# EAGLE design hula_poppy (EAGLE 6.4)

## Sheet 1 of 2
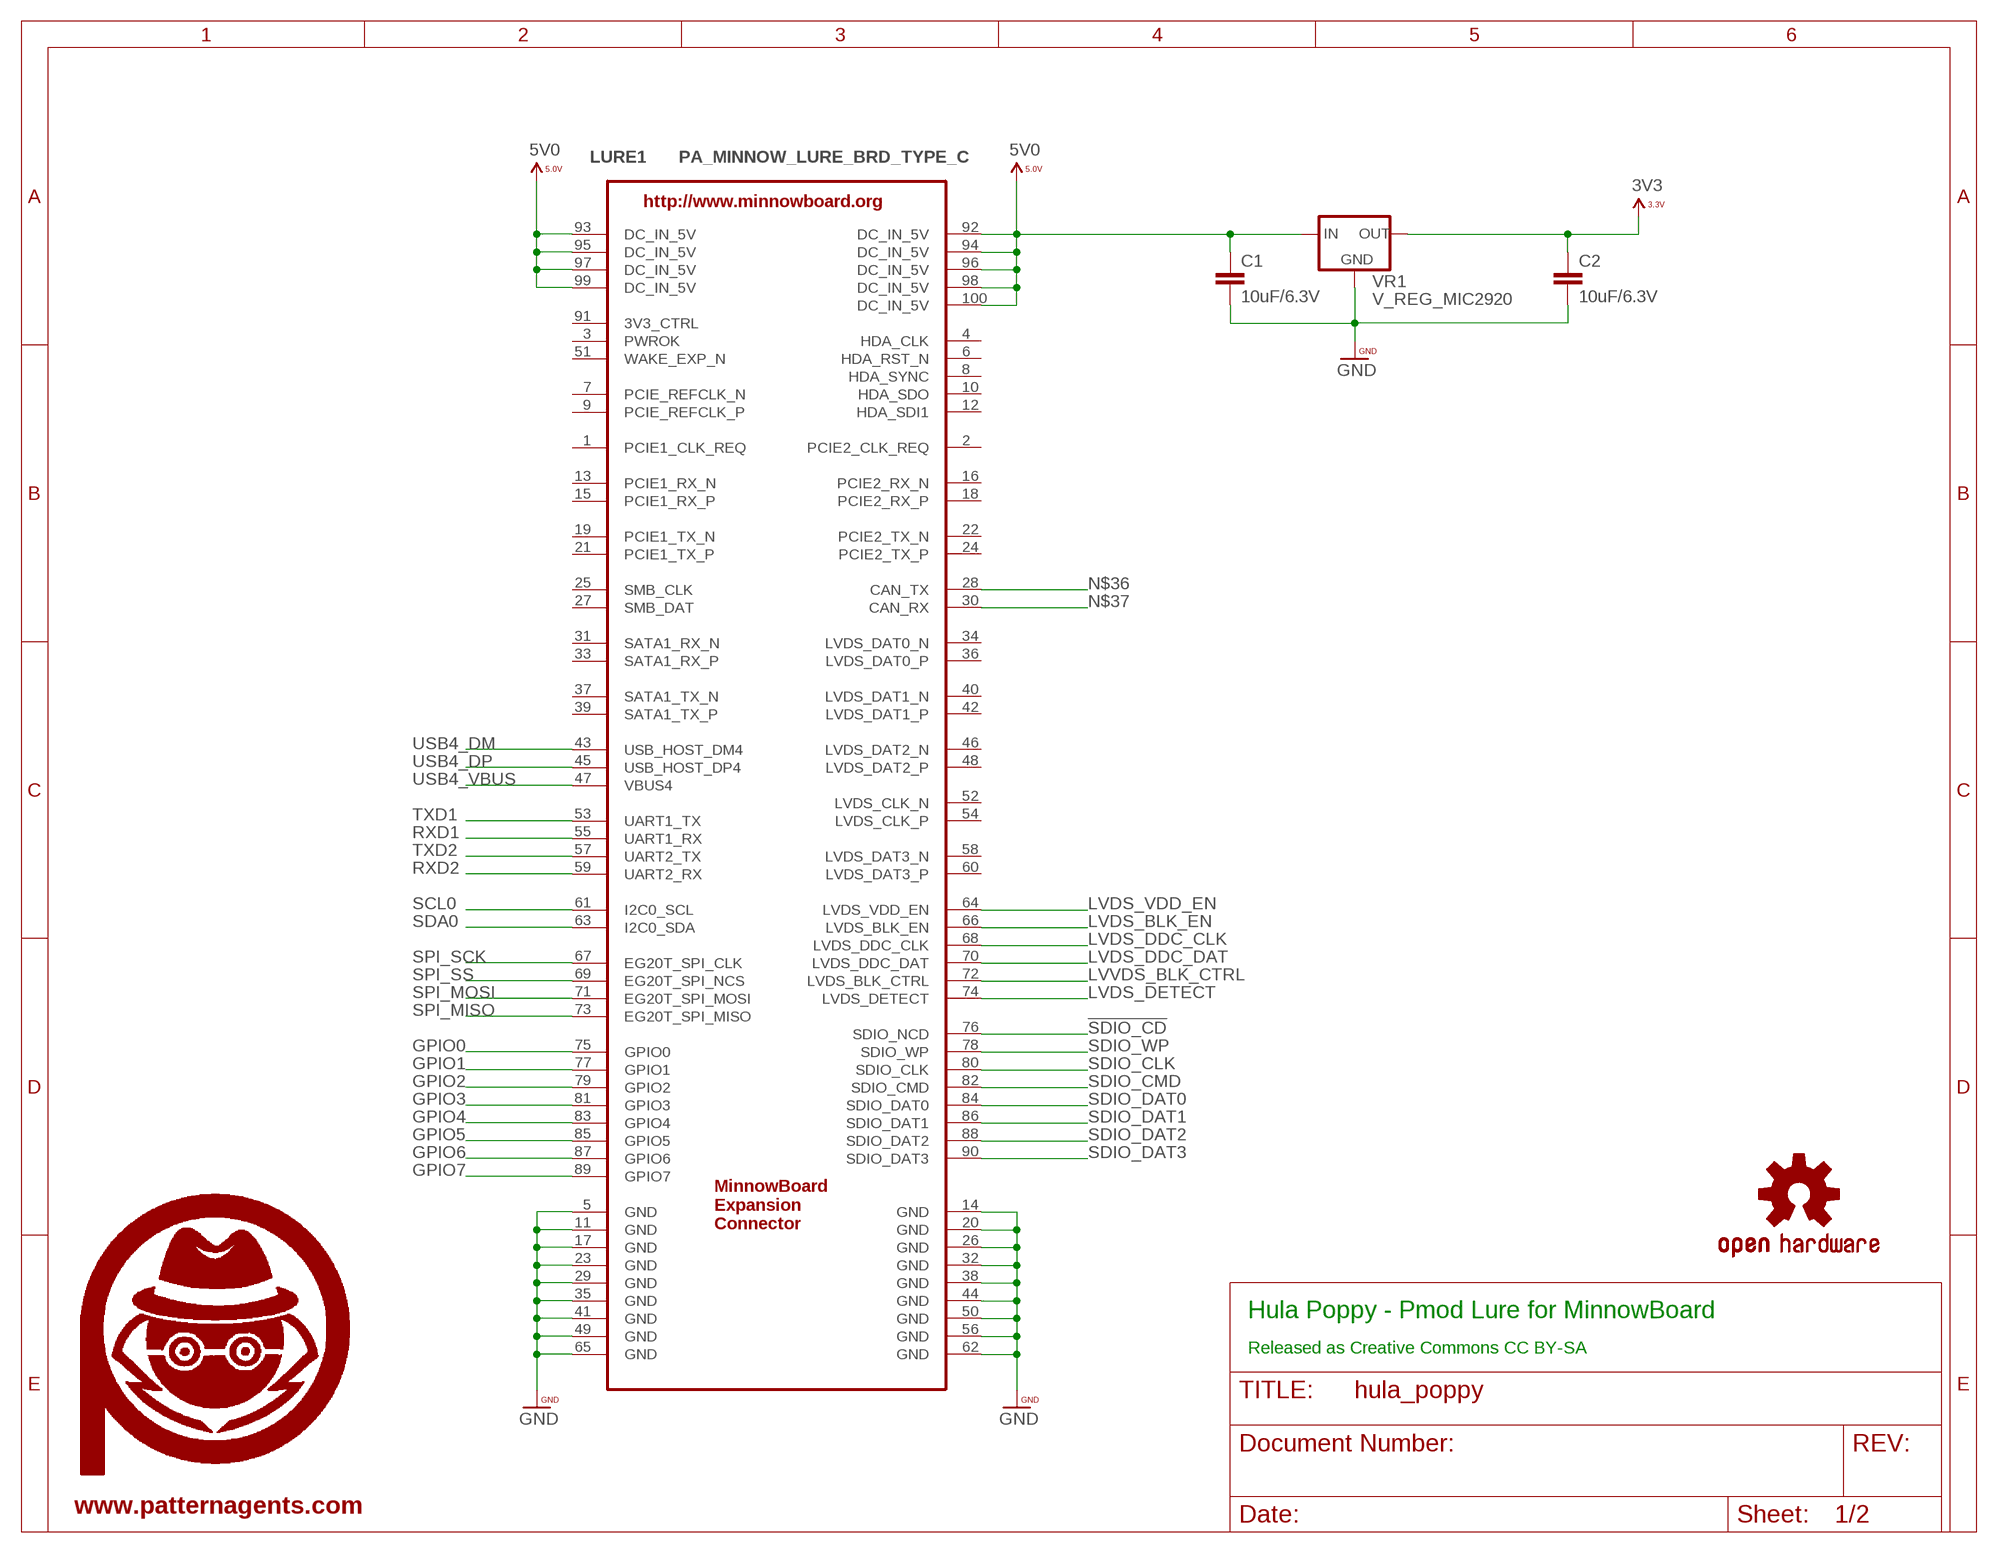
[diagram p0: schematic, sheet 1]

### Parts
C1  10uF/6.3V  CAP0603-CAP  [0603-CAP]
C2  10uF/6.3V  CAP0603-CAP  [0603-CAP]
LURE1  PA_MINNOW_LURE_BRD_TYPE_C  [PA_LURE_TYPE_C]
U$6  PA_LOGO_SYMMED  [PA_LOGO_AGENT_MED_SYM]
U$8  OSHW_LOGO_SYMWTXT  [OSHW_LOGO_TEXT_SYM]
VR1  V_REG_MIC2920  [SOT223]

### Nets
3V3: C2.1 VR1.3(OUT) ; also sheet 2
5V0: C1.1 LURE1.92(DC_IN_5V) LURE1.93(DC_IN_5V) LURE1.94(DC_IN_5V) LURE1.95(DC_IN_5V) LURE1.96(DC_IN_5V) LURE1.97(DC_IN_5V) LURE1.98(DC_IN_5V) LURE1.99(DC_IN_5V) LURE1.100(DC_IN_5V) VR1.1(IN)
!SDIO_CD: LURE1.76(SDIO_NCD) ; also sheet 2
GND: C1.2 C2.2 LURE1.5(GND) LURE1.11(GND) LURE1.14(GND) LURE1.17(GND) LURE1.20(GND) LURE1.23(GND) LURE1.26(GND) LURE1.29(GND) LURE1.32(GND) LURE1.35(GND) LURE1.38(GND) LURE1.41(GND) LURE1.44(GND) LURE1.49(GND) LURE1.50(GND) LURE1.56(GND) LURE1.62(GND) LURE1.65(GND) VR1.2(GND) ; also sheet 2
GPIO0: LURE1.75(GPIO0) ; also sheet 2
GPIO1: LURE1.77(GPIO1) ; also sheet 2
GPIO2: LURE1.79(GPIO2) ; also sheet 2
GPIO3: LURE1.81(GPIO3) ; also sheet 2
GPIO4: LURE1.83(GPIO4) ; also sheet 2
GPIO5: LURE1.85(GPIO5) ; also sheet 2
GPIO6: LURE1.87(GPIO6) ; also sheet 2
GPIO7: LURE1.89(GPIO7) ; also sheet 2
LVDS_BLK_EN: LURE1.66(LVDS_BLK_EN)
LVDS_DDC_CLK: LURE1.68(LVDS_DDC_CLK)
LVDS_DDC_DAT: LURE1.70(LVDS_DDC_DAT)
LVDS_DETECT: LURE1.74(LVDS_DETECT)
LVDS_VDD_EN: LURE1.64(LVDS_VDD_EN)
LVVDS_BLK_CTRL: LURE1.72(LVDS_BLK_CTRL)
N$36: LURE1.28(CAN_TX)
N$37: LURE1.30(CAN_RX)
RXD1: LURE1.55(UART1_RX) ; also sheet 2
RXD2: LURE1.59(UART2_RX) ; also sheet 2
SCL0: LURE1.61(I2C0_SCL) ; also sheet 2
SDA0: LURE1.63(I2C0_SDA) ; also sheet 2
SDIO_CLK: LURE1.80(SDIO_CLK) ; also sheet 2
SDIO_CMD: LURE1.82(SDIO_CMD) ; also sheet 2
SDIO_DAT0: LURE1.84(SDIO_DAT0) ; also sheet 2
SDIO_DAT1: LURE1.86(SDIO_DAT1) ; also sheet 2
SDIO_DAT2: LURE1.88(SDIO_DAT2) ; also sheet 2
SDIO_DAT3: LURE1.90(SDIO_DAT3) ; also sheet 2
SDIO_WP: LURE1.78(SDIO_WP) ; also sheet 2
SPI_MISO: LURE1.73(EG20T_SPI_MISO) ; also sheet 2
SPI_MOSI: LURE1.71(EG20T_SPI_MOSI) ; also sheet 2
SPI_SCK: LURE1.67(EG20T_SPI_CLK) ; also sheet 2
SPI_SS: LURE1.69(EG20T_SPI_NCS) ; also sheet 2
TXD1: LURE1.53(UART1_TX) ; also sheet 2
TXD2: LURE1.57(UART2_TX) ; also sheet 2
USB4_DM: LURE1.43(USB_HOST_DM4)
USB4_DP: LURE1.45(USB_HOST_DP4)
USB4_VBUS: LURE1.47(VBUS4)
Unconnected: LURE1.1(PCIE1_CLK_REQ) LURE1.2(PCIE2_CLK_REQ) LURE1.3(PWROK) LURE1.4(HDA_CLK) LURE1.6(HDA_RST_N) LURE1.7(PCIE_REFCLK_N) LURE1.8(HDA_SYNC) LURE1.9(PCIE_REFCLK_P) LURE1.10(HDA_SDO) LURE1.12(HDA_SDI1) LURE1.13(PCIE1_RX_N) LURE1.15(PCIE1_RX_P) LURE1.16(PCIE2_RX_N) LURE1.18(PCIE2_RX_P) LURE1.19(PCIE1_TX_N) LURE1.21(PCIE1_TX_P) LURE1.22(PCIE2_TX_N) LURE1.24(PCIE2_TX_P) LURE1.25(SMB_CLK) LURE1.27(SMB_DAT) LURE1.31(SATA1_RX_N) LURE1.33(SATA1_RX_P) LURE1.34(LVDS_DAT0_N) LURE1.36(LVDS_DAT0_P) LURE1.37(SATA1_TX_N) LURE1.39(SATA1_TX_P) LURE1.40(LVDS_DAT1_N) LURE1.42(LVDS_DAT1_P) LURE1.46(LVDS_DAT2_N) LURE1.48(LVDS_DAT2_P) LURE1.51(WAKE_EXP_N) LURE1.52(LVDS_CLK_N) LURE1.54(LVDS_CLK_P) LURE1.58(LVDS_DAT3_N) LURE1.60(LVDS_DAT3_P)

### Notes on the sheet
- Hula Poppy - Pmod Lure for MinnowBoard
- Released as Creative Commons CC BY-SA
- www.patternagents.com

## Sheet 2 of 2
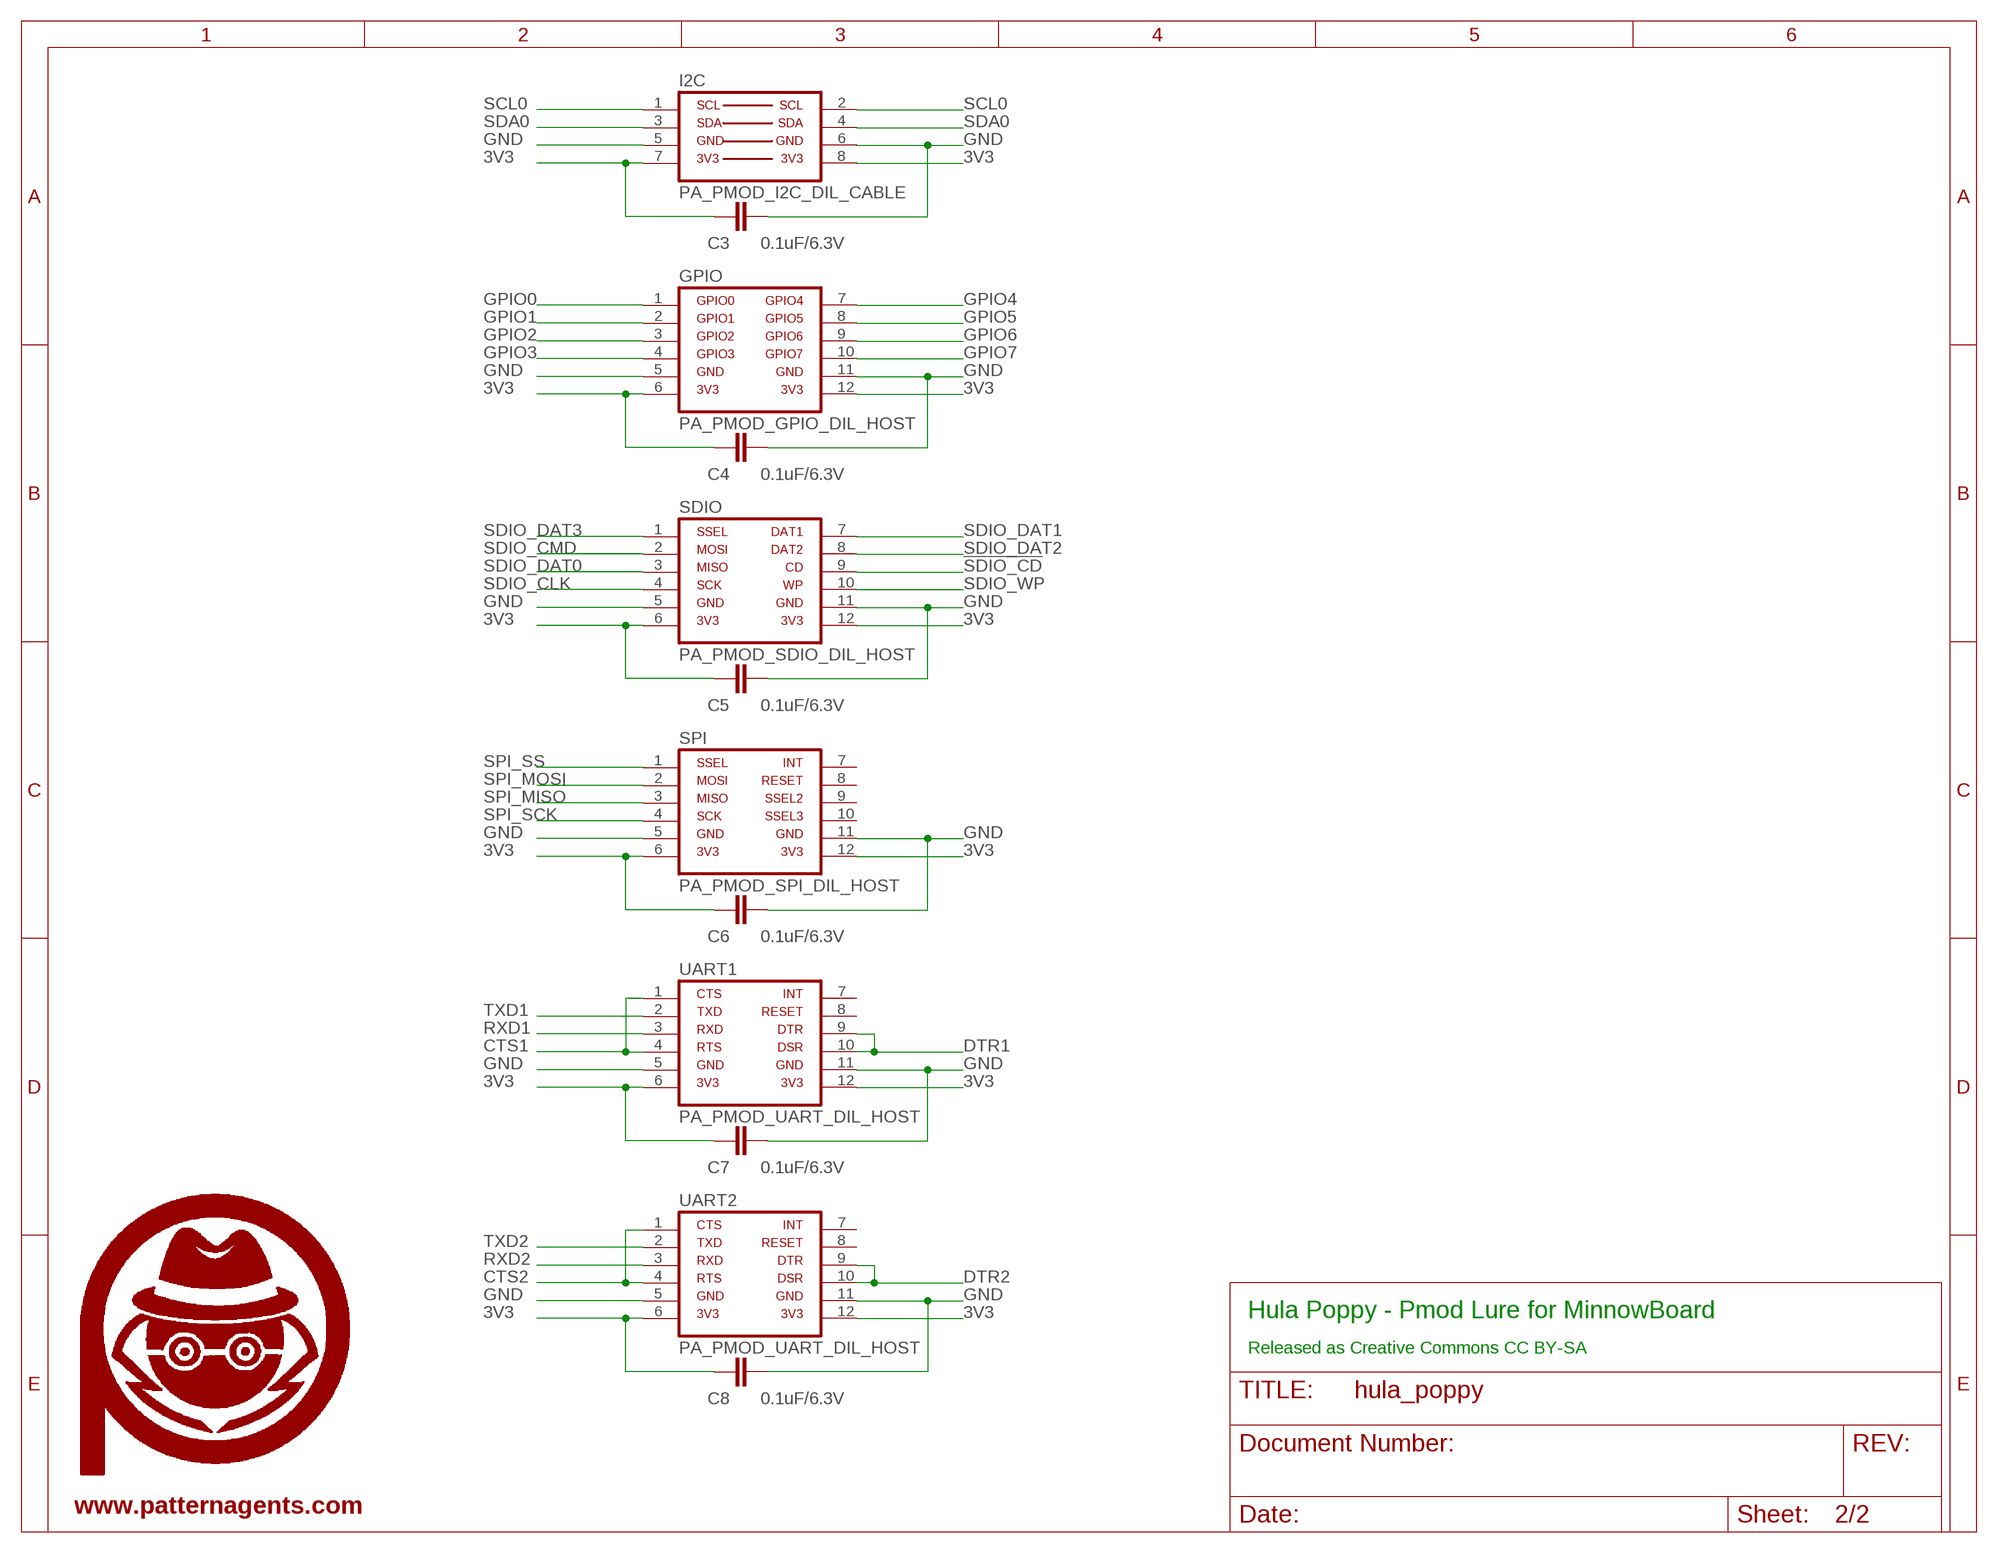
[diagram p1: schematic, sheet 2]

### Parts
C3  0.1uF/6.3V  CAP0603-CAP  [0603-CAP]
C4  0.1uF/6.3V  CAP0603-CAP  [0603-CAP]
C5  0.1uF/6.3V  CAP0603-CAP  [0603-CAP]
C6  0.1uF/6.3V  CAP0603-CAP  [0603-CAP]
C7  0.1uF/6.3V  CAP0603-CAP  [0603-CAP]
C8  0.1uF/6.3V  CAP0603-CAP  [0603-CAP]
GPIO  PA_PMOD_GPIO_DIL_HOST  [PA_PMOD_DIL_FEMALE]
I2C  PA_PMOD_I2C_DIL_CABLE  [PA_PMOD_I2C_CABLE]
SDIO  PA_PMOD_SDIO_DIL_HOST  [PA_PMOD_DIL_FEMALE]
SPI  PA_PMOD_SPI_DIL_HOST  [PA_PMOD_DIL_FEMALE]
U$10  PA_LOGO_SYMMED  [PA_LOGO_AGENT_MED_SYM]
UART1  PA_PMOD_UART_DIL_HOST  [PA_PMOD_DIL_FEMALE]
UART2  PA_PMOD_UART_DIL_HOST  [PA_PMOD_DIL_FEMALE]

### Nets
3V3: C3.2 C4.2 C5.2 C6.2 C7.2 C8.2 GPIO.6 GPIO.12 I2C.7 I2C.8 SDIO.6 SDIO.12 SPI.6 SPI.12 UART1.6 UART1.12 UART2.6 UART2.12 ; also sheet 1
!SDIO_CD: SDIO.9 ; also sheet 1
CTS1: UART1.1 UART1.4
CTS2: UART2.1 UART2.4
DTR1: UART1.9 UART1.10
DTR2: UART2.9 UART2.10
GND: C3.1 C4.1 C5.1 C6.1 C7.1 C8.1 GPIO.5 GPIO.11 I2C.5 I2C.6 SDIO.5 SDIO.11 SPI.5 SPI.11 UART1.5 UART1.11 UART2.5 UART2.11 ; also sheet 1
GPIO0: GPIO.1 ; also sheet 1
GPIO1: GPIO.2 ; also sheet 1
GPIO2: GPIO.3 ; also sheet 1
GPIO3: GPIO.4 ; also sheet 1
GPIO4: GPIO.7 ; also sheet 1
GPIO5: GPIO.8 ; also sheet 1
GPIO6: GPIO.9 ; also sheet 1
GPIO7: GPIO.10 ; also sheet 1
RXD1: UART1.3 ; also sheet 1
RXD2: UART2.3 ; also sheet 1
SCL0: I2C.1 I2C.2 ; also sheet 1
SDA0: I2C.3 I2C.4 ; also sheet 1
SDIO_CLK: SDIO.4 ; also sheet 1
SDIO_CMD: SDIO.2 ; also sheet 1
SDIO_DAT0: SDIO.3 ; also sheet 1
SDIO_DAT1: SDIO.7 ; also sheet 1
SDIO_DAT2: SDIO.8 ; also sheet 1
SDIO_DAT3: SDIO.1 ; also sheet 1
SDIO_WP: SDIO.10 ; also sheet 1
SPI_MISO: SPI.3 ; also sheet 1
SPI_MOSI: SPI.2 ; also sheet 1
SPI_SCK: SPI.4 ; also sheet 1
SPI_SS: SPI.1 ; also sheet 1
TXD1: UART1.2 ; also sheet 1
TXD2: UART2.2 ; also sheet 1
Unconnected: SPI.7 SPI.8 SPI.9 SPI.10 UART1.7 UART1.8 UART2.7 UART2.8

### Notes on the sheet
- Hula Poppy - Pmod Lure for MinnowBoard
- Released as Creative Commons CC BY-SA
- www.patternagents.com

## Power pins joined to a net without a drawn wire
3V3_CTRL: LURE1.91(3V3_CTRL)

## Library data of the parts
C1-C8 = PatternAgents-Misc:CAP: Capacitor Standard 0603 ceramic capacitor, and 0.1" leaded capacitor.
GPIO = PatternAgents_Interface:PA_PMOD_GPIO_DIL: PatternAgents Peripheral Module GPIO (Type 1A) Pattern Source LBR : http://www.patternagents.com Github : https://github.com/patternagents Source License : http://www.digilentinc.com/Pmods/licensing.cfm Source Data : http://www.digilentinc.com/Pmods/Digilent-Pmod_%20Interface_Specification.pdf The name "Pmod™" is the trademark of Digilent Inc. PA Pattern License : http://creativecommons.org/licenses/by-sa/4.0/ (Creative Commons 4.0) THIS SOFTWARE IS PROVIDED BY THE CONTRIBUTORS "AS IS" AND WITHOUT ANY EXPRESS OR IMPLIED WARRANTIES, INCLUDING, BUT NOT LIMITED TO, THE IMPLIED WARRANTIES OF MERCHANTABILITY AND FITNESS FOR A PARTICULAR PURPOSE ARE DISCLAIMED. IN NO EVENT SHALL THE COPYRIGHT OWNER OR CONTRIBUTORS BE LIABLE FOR ANY DIRECT, INDIRECT, INCIDENTAL, SPECIAL, EXEMPLARY, OR CONSEQUENTIAL DAMAGES (INCLUDING, BUT NOT LIMITED TO, PROCUREMENT OF SUBSTITUTE GOODS OR SERVICES; LOSS OF USE, DATA, OR PROFITS; OR BUSINESS INTERRUPTION) HOWEVER CAUSED AND ON ANY THEORY OF LIABILITY, WHETHER IN CONTRACT, STRICT LIABILITY, OR TORT (INCLUDING NEGLIGENCE OR OTHERWISE) ARISING IN ANY WAY OUT OF THE USE OF THIS SOFTWARE, EVEN IF ADVISED OF THE POSSIBILITY OF SUCH DAMAGE.
I2C = PatternAgents_Interface:PA_PMOD_I2C_DIL: PatternAgents Peripheral Module I2C (Standard) Pattern Source LBR : http://www.patternagents.com Github : https://github.com/patternagents Source License : http://www.digilentinc.com/Pmods/licensing.cfm Source Data : http://www.digilentinc.com/Pmods/Digilent-Pmod_%20Interface_Specification.pdf The name "Pmod™" is the trademark of Digilent Inc. PA Pattern License : http://creativecommons.org/licenses/by-sa/4.0/ (Creative Commons 4.0) THIS SOFTWARE IS PROVIDED BY THE CONTRIBUTORS "AS IS" AND WITHOUT ANY EXPRESS OR IMPLIED WARRANTIES, INCLUDING, BUT NOT LIMITED TO, THE IMPLIED WARRANTIES OF MERCHANTABILITY AND FITNESS FOR A PARTICULAR PURPOSE ARE DISCLAIMED. IN NO EVENT SHALL THE COPYRIGHT OWNER OR CONTRIBUTORS BE LIABLE FOR ANY DIRECT, INDIRECT, INCIDENTAL, SPECIAL, EXEMPLARY, OR CONSEQUENTIAL DAMAGES (INCLUDING, BUT NOT LIMITED TO, PROCUREMENT OF SUBSTITUTE GOODS OR SERVICES; LOSS OF USE, DATA, OR PROFITS; OR BUSINESS INTERRUPTION) HOWEVER CAUSED AND ON ANY THEORY OF LIABILITY, WHETHER IN CONTRACT, STRICT LIABILITY, OR TORT (INCLUDING NEGLIGENCE OR OTHERWISE) ARISING IN ANY WAY OUT OF THE USE OF THIS SOFTWARE, EVEN IF ADVISED OF THE POSSIBILITY OF SUCH DAMAGE.
LURE1 = PatternAgents-Boards:PA_MINNOW_LURE_BRD: PatternAgents Minnow Lure Pattern Source LBR : http://www.patternagents.com Github : https://github.com/patternagents Source Data : http://www.minnowboard.org/ Source Data : http://www.elinux.org/Minnowboard:Lures_Specifications Note Bene : The larger "Type A" format Lures will require a Standard or Professional Eagle License, due to their larger size (4.2" x 4.2"). License : http://creativecommons.org/licenses/by-sa/4.0/ (Creative Commons 4.0) THIS SOFTWARE IS PROVIDED BY THE CONTRIBUTORS "AS IS" AND WITHOUT ANY EXPRESS OR IMPLIED WARRANTIES, INCLUDING, BUT NOT LIMITED TO, THE IMPLIED WARRANTIES OF MERCHANTABILITY AND FITNESS FOR A PARTICULAR PURPOSE ARE DISCLAIMED. IN NO EVENT SHALL THE COPYRIGHT OWNER OR CONTRIBUTORS BE LIABLE FOR ANY DIRECT, INDIRECT, INCIDENTAL, SPECIAL, EXEMPLARY, OR CONSEQUENTIAL DAMAGES (INCLUDING, BUT NOT LIMITED TO, PROCUREMENT OF SUBSTITUTE GOODS OR SERVICES; LOSS OF USE, DATA, OR PROFITS; OR BUSINESS INTERRUPTION) HOWEVER CAUSED AND ON ANY THEORY OF LIABILITY, WHETHER IN CONTRACT, STRICT LIABILITY, OR TORT (INCLUDING NEGLIGENCE OR OTHERWISE) ARISING IN ANY WAY OUT OF THE USE OF THIS SOFTWARE, EVEN IF ADVISED OF THE POSSIBILITY OF SUCH DAMAGE.
SDIO = PatternAgents_Interface:PA_PMOD_SDIO_DIL: PatternAgents Peripheral Module SDIO (Type 2B) Pattern Source LBR : http://www.patternagents.com Github : https://github.com/patternagents Source License : http://www.digilentinc.com/Pmods/licensing.cfm Source Data : http://www.digilentinc.com/Pmods/Digilent-Pmod_%20Interface_Specification.pdf The name "Pmod™" is the trademark of Digilent Inc. PA Pattern License : http://creativecommons.org/licenses/by-sa/4.0/ (Creative Commons 4.0) THIS SOFTWARE IS PROVIDED BY THE CONTRIBUTORS "AS IS" AND WITHOUT ANY EXPRESS OR IMPLIED WARRANTIES, INCLUDING, BUT NOT LIMITED TO, THE IMPLIED WARRANTIES OF MERCHANTABILITY AND FITNESS FOR A PARTICULAR PURPOSE ARE DISCLAIMED. IN NO EVENT SHALL THE COPYRIGHT OWNER OR CONTRIBUTORS BE LIABLE FOR ANY DIRECT, INDIRECT, INCIDENTAL, SPECIAL, EXEMPLARY, OR CONSEQUENTIAL DAMAGES (INCLUDING, BUT NOT LIMITED TO, PROCUREMENT OF SUBSTITUTE GOODS OR SERVICES; LOSS OF USE, DATA, OR PROFITS; OR BUSINESS INTERRUPTION) HOWEVER CAUSED AND ON ANY THEORY OF LIABILITY, WHETHER IN CONTRACT, STRICT LIABILITY, OR TORT (INCLUDING NEGLIGENCE OR OTHERWISE) ARISING IN ANY WAY OUT OF THE USE OF THIS SOFTWARE, EVEN IF ADVISED OF THE POSSIBILITY OF SUCH DAMAGE.
SPI = PatternAgents_Interface:PA_PMOD_SPI_DIL: PatternAgents Peripheral Module SPI (Type 2A) Pattern Source LBR : http://www.patternagents.com Github : https://github.com/patternagents Source License : http://www.digilentinc.com/Pmods/licensing.cfm Source Data : http://www.digilentinc.com/Pmods/Digilent-Pmod_%20Interface_Specification.pdf The name "Pmod™" is the trademark of Digilent Inc. PA Pattern License : http://creativecommons.org/licenses/by-sa/4.0/ (Creative Commons 4.0) THIS SOFTWARE IS PROVIDED BY THE CONTRIBUTORS "AS IS" AND WITHOUT ANY EXPRESS OR IMPLIED WARRANTIES, INCLUDING, BUT NOT LIMITED TO, THE IMPLIED WARRANTIES OF MERCHANTABILITY AND FITNESS FOR A PARTICULAR PURPOSE ARE DISCLAIMED. IN NO EVENT SHALL THE COPYRIGHT OWNER OR CONTRIBUTORS BE LIABLE FOR ANY DIRECT, INDIRECT, INCIDENTAL, SPECIAL, EXEMPLARY, OR CONSEQUENTIAL DAMAGES (INCLUDING, BUT NOT LIMITED TO, PROCUREMENT OF SUBSTITUTE GOODS OR SERVICES; LOSS OF USE, DATA, OR PROFITS; OR BUSINESS INTERRUPTION) HOWEVER CAUSED AND ON ANY THEORY OF LIABILITY, WHETHER IN CONTRACT, STRICT LIABILITY, OR TORT (INCLUDING NEGLIGENCE OR OTHERWISE) ARISING IN ANY WAY OUT OF THE USE OF THIS SOFTWARE, EVEN IF ADVISED OF THE POSSIBILITY OF SUCH DAMAGE.
U$6 U$10 = PatternAgents-Logos:PA_LOGO_SYM: PatternAgents Logo Symbol Trademark : PatternAgents, LLC Github : https://github.com/PatternAgents/PCB_Libraries License : http://creativecommons.org/licenses/by-sa/3.0/ (Creative Commons 3.0) THIS SOFTWARE IS PROVIDED BY THE CONTRIBUTORS "AS IS" AND WITHOUT ANY EXPRESS OR IMPLIED WARRANTIES, INCLUDING, BUT NOT LIMITED TO, THE IMPLIED WARRANTIES OF MERCHANTABILITY AND FITNESS FOR A PARTICULAR PURPOSE ARE DISCLAIMED. IN NO EVENT SHALL THE COPYRIGHT OWNER OR CONTRIBUTORS BE LIABLE FOR ANY DIRECT, INDIRECT, INCIDENTAL, SPECIAL, EXEMPLARY, OR CONSEQUENTIAL DAMAGES (INCLUDING, BUT NOT LIMITED TO, PROCUREMENT OF SUBSTITUTE GOODS OR SERVICES; LOSS OF USE, DATA, OR PROFITS; OR BUSINESS INTERRUPTION) HOWEVER CAUSED AND ON ANY THEORY OF LIABILITY, WHETHER IN CONTRACT, STRICT LIABILITY, OR TORT (INCLUDING NEGLIGENCE OR OTHERWISE) ARISING IN ANY WAY OUT OF THE USE OF THIS SOFTWARE, EVEN IF ADVISED OF THE POSSIBILITY OF SUCH DAMAGE.
U$8 = PatternAgents-Logos:OSHW_LOGO_SYM: OSHW_LOGO_SYM Source : http://freedomdefined.org/OSHW#Logo_repository Github : https://github.com/PatternAgents/PCB_Libraries License : http://creativecommons.org/licenses/by-sa/3.0/ (Creative Commons 3.0) THIS SOFTWARE IS PROVIDED BY THE CONTRIBUTORS "AS IS" AND WITHOUT ANY EXPRESS OR IMPLIED WARRANTIES, INCLUDING, BUT NOT LIMITED TO, THE IMPLIED WARRANTIES OF MERCHANTABILITY AND FITNESS FOR A PARTICULAR PURPOSE ARE DISCLAIMED. IN NO EVENT SHALL THE COPYRIGHT OWNER OR CONTRIBUTORS BE LIABLE FOR ANY DIRECT, INDIRECT, INCIDENTAL, SPECIAL, EXEMPLARY, OR CONSEQUENTIAL DAMAGES (INCLUDING, BUT NOT LIMITED TO, PROCUREMENT OF SUBSTITUTE GOODS OR SERVICES; LOSS OF USE, DATA, OR PROFITS; OR BUSINESS INTERRUPTION) HOWEVER CAUSED AND ON ANY THEORY OF LIABILITY, WHETHER IN CONTRACT, STRICT LIABILITY, OR TORT (INCLUDING NEGLIGENCE OR OTHERWISE) ARISING IN ANY WAY OUT OF THE USE OF THIS SOFTWARE, EVEN IF ADVISED OF THE POSSIBILITY OF SUCH DAMAGE.
UART1 UART2 = PatternAgents_Interface:PA_PMOD_UART_DIL: PatternAgents Peripheral Module UART (Type 4A) Pattern Source LBR : http://www.patternagents.com Github : https://github.com/patternagents Source License : http://www.digilentinc.com/Pmods/licensing.cfm Source Data : http://www.digilentinc.com/Pmods/Digilent-Pmod_%20Interface_Specification.pdf The name "Pmod™" is the trademark of Digilent Inc. PA Pattern License : http://creativecommons.org/licenses/by-sa/4.0/ (Creative Commons 4.0) THIS SOFTWARE IS PROVIDED BY THE CONTRIBUTORS "AS IS" AND WITHOUT ANY EXPRESS OR IMPLIED WARRANTIES, INCLUDING, BUT NOT LIMITED TO, THE IMPLIED WARRANTIES OF MERCHANTABILITY AND FITNESS FOR A PARTICULAR PURPOSE ARE DISCLAIMED. IN NO EVENT SHALL THE COPYRIGHT OWNER OR CONTRIBUTORS BE LIABLE FOR ANY DIRECT, INDIRECT, INCIDENTAL, SPECIAL, EXEMPLARY, OR CONSEQUENTIAL DAMAGES (INCLUDING, BUT NOT LIMITED TO, PROCUREMENT OF SUBSTITUTE GOODS OR SERVICES; LOSS OF USE, DATA, OR PROFITS; OR BUSINESS INTERRUPTION) HOWEVER CAUSED AND ON ANY THEORY OF LIABILITY, WHETHER IN CONTRACT, STRICT LIABILITY, OR TORT (INCLUDING NEGLIGENCE OR OTHERWISE) ARISING IN ANY WAY OUT OF THE USE OF THIS SOFTWARE, EVEN IF ADVISED OF THE POSSIBILITY OF SUCH DAMAGE.
VR1 = PatternAgents-BLDC:V_REG_MIC2920: MIC2920A (http://www.micrel.com/_PDF/mic2920.pdf) - 400mA output LDO Regulator

## Board
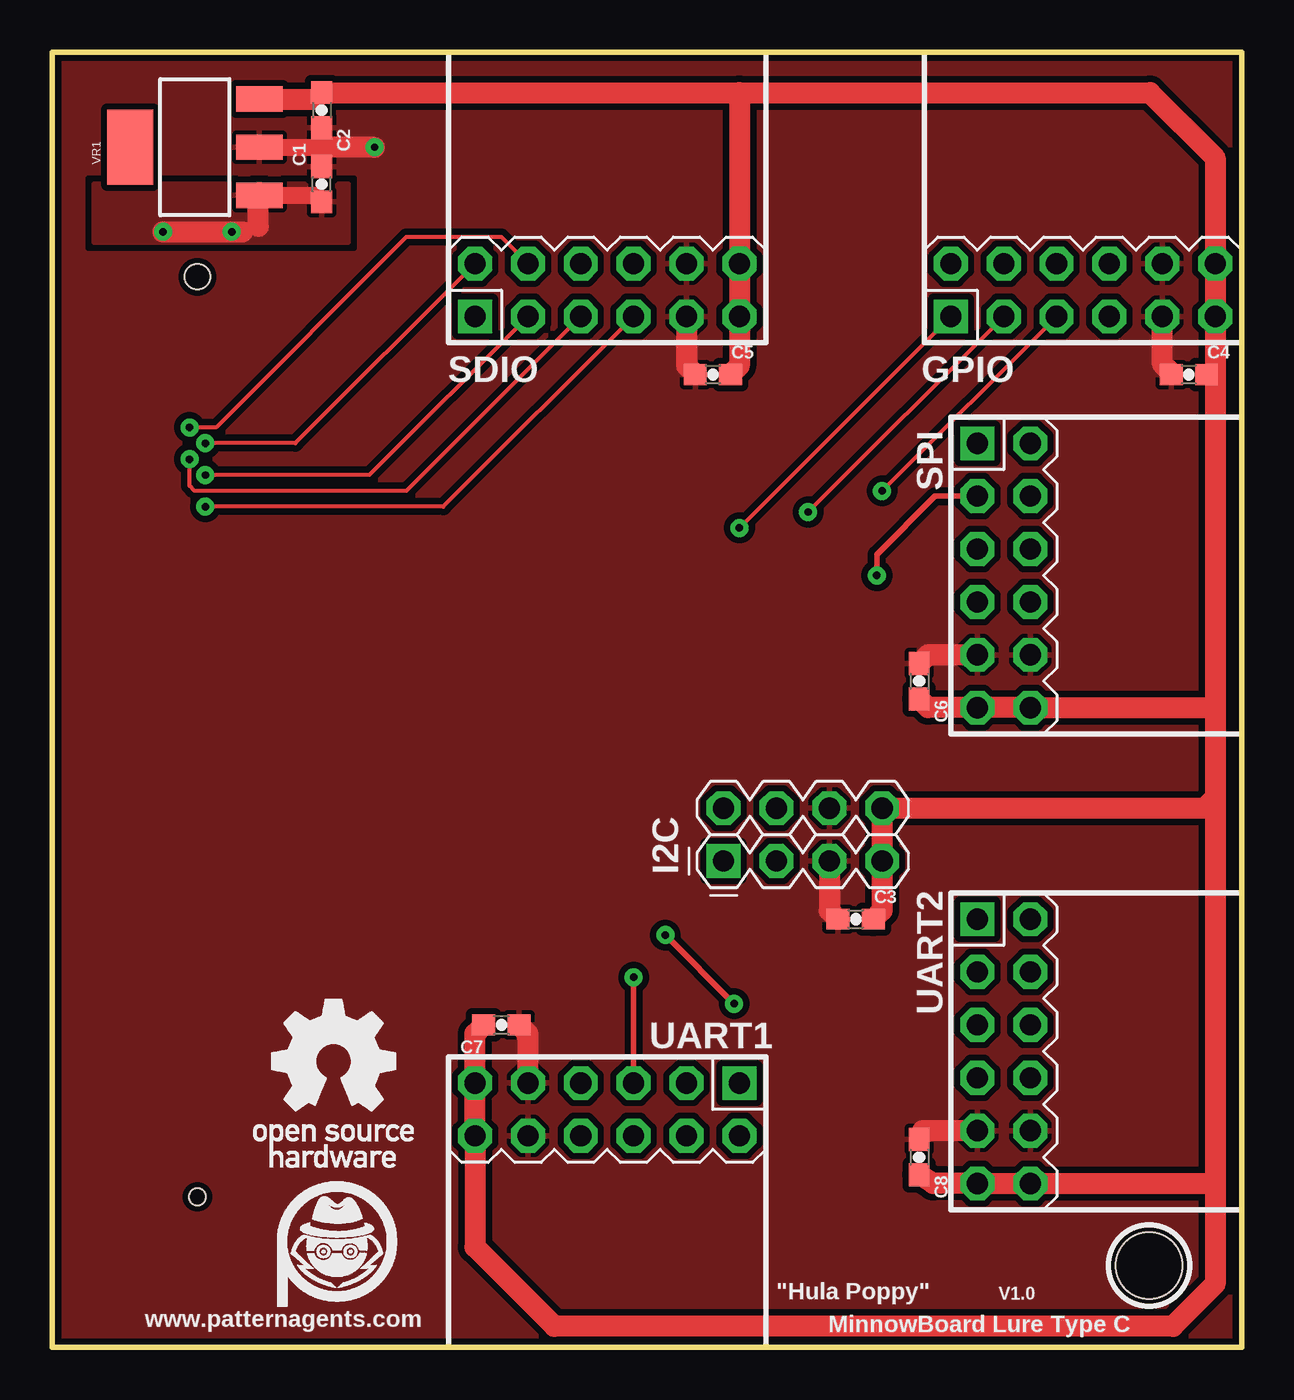
[diagram p2: board, top side]
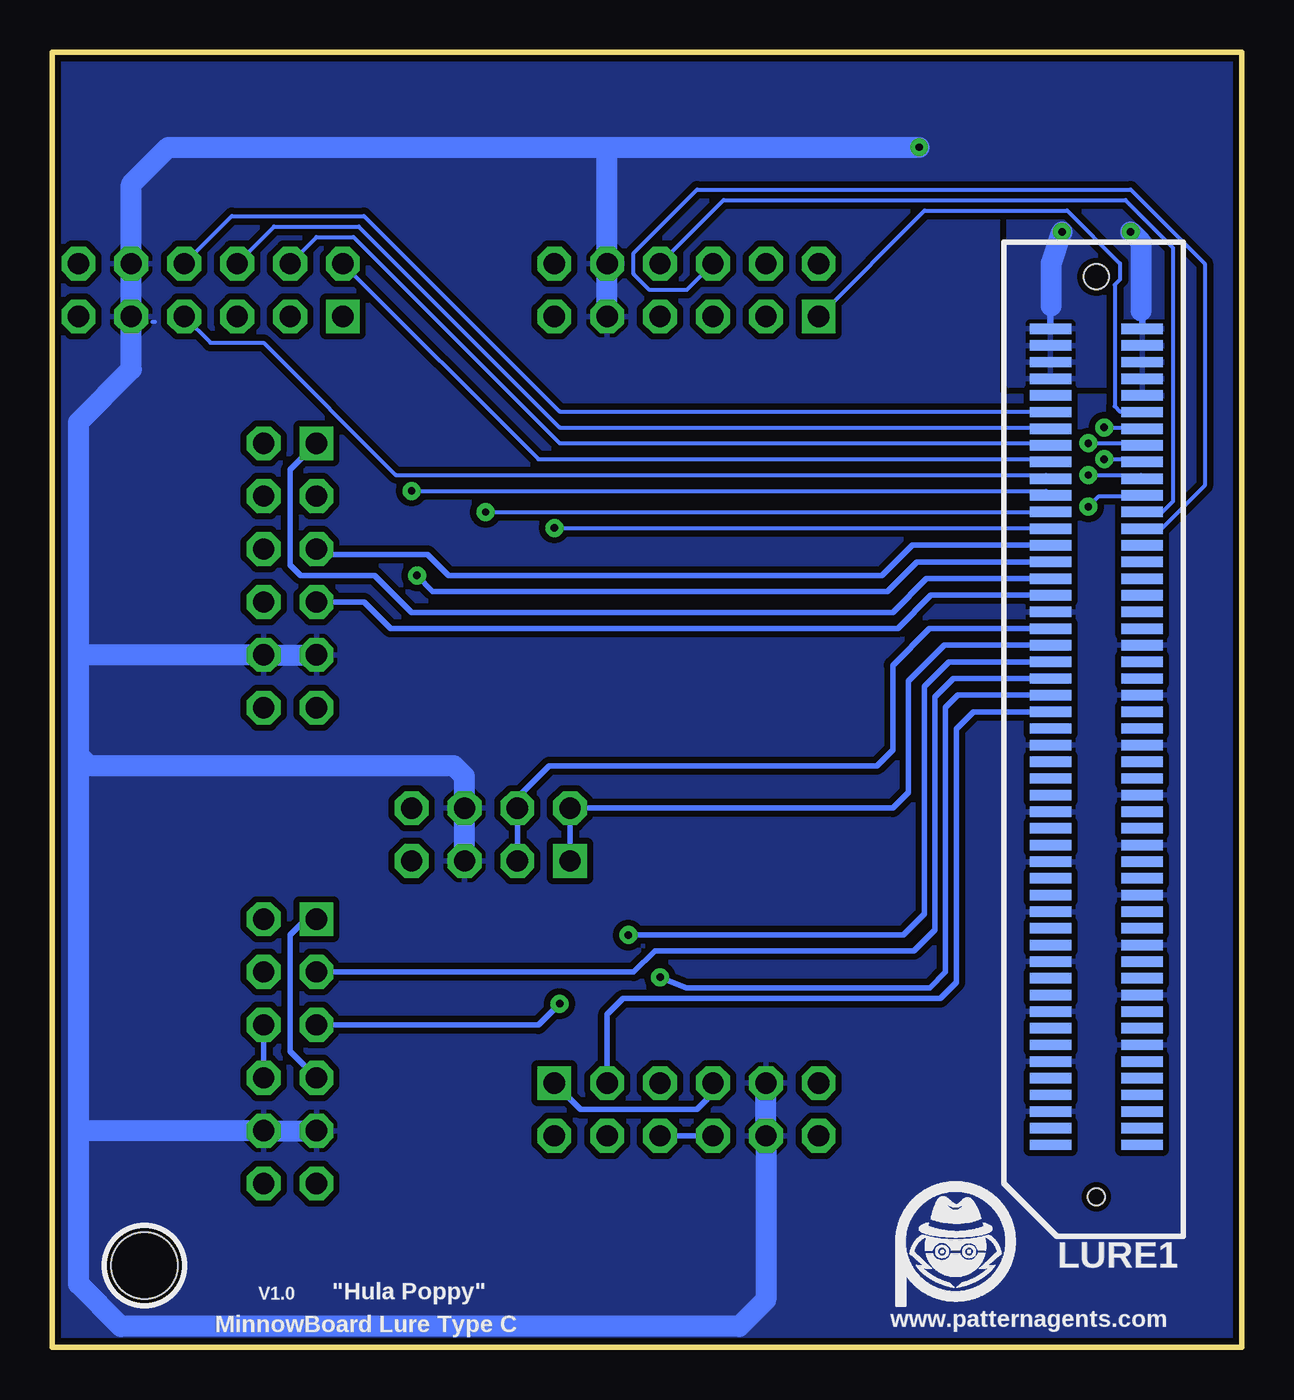
[diagram p3: board, bottom side, seen from below]

Size 57.15 x 62.23 mm. Coordinates in mm from the lower left corner, seen from the top.
Copper layers (1*16): Top 0.035mm / dielectric 1.5mm / Bottom 0.035mm
Design rules "PatternAgents": minimum track width 8mil, minimum drill 14mil, track to track 8mil, track to pad 8mil, pad to pad 8mil, via to via 8mil, smd to smd 8mil, copper to edge 10mil, drill to drill 8mil, minimum pad ring 12mil, minimum via ring 10mil, stop-mask expansion 4mil, vias tented up to drill 25mil, thermal gap 8mil

### Footprints (pad centres in the part's own frame; a part is rotated, then mirrored left to right if it is on the bottom)
0603-CAP = smd 1.1 x 1: 1 -0.85,0; 2 0.85,0
PA_PMOD_DIL_FEMALE = drill 1.016 square: 1 -1.27,6.35 | drill 1.016 octagon: 2 -1.27,3.81; 3 -1.27,1.27; 4 -1.27,-1.27; 5 -1.27,-3.81; 6 -1.27,-6.35; 7 1.27,6.35; 8 1.27,3.81; 9 1.27,1.27; 10 1.27,-1.27; 11 1.27,-3.81; 12 1.27,-6.35
PA_PMOD_I2C_CABLE = drill 1.016 square: 1 -1.27,3.81 | drill 1.016 octagon: 2 1.27,3.81; 3 -1.27,1.27; 4 1.27,1.27; 5 -1.27,-1.27; 6 1.27,-1.27; 7 -1.27,-3.81; 8 1.27,-3.81
PA_LURE_TYPE_C = smd 2 x 0.5 bottom: 1 9.185,9.734; 2 4.785,9.734; 3 9.185,10.534; 4 4.785,10.534; 5 9.185,11.334; 6 4.785,11.334; 7 9.185,12.134; 8 4.785,12.134; 9 9.185,12.934; 10 4.785,12.934; 11 9.185,13.734; 12 4.785,13.734; 13 9.185,14.534; 14 4.785,14.534; 15 9.185,15.334; 16 4.785,15.334; 17 9.185,16.134; 18 4.785,16.134; 19 9.185,16.934; 20 4.785,16.934; 21 9.185,17.734; 22 4.785,17.734; 23 9.185,18.534; 24 4.785,18.534; 25 9.185,19.334; 26 4.785,19.334; 27 9.185,20.134; 28 4.785,20.134; 29 9.185,20.934; 30 4.785,20.934; 31 9.185,21.734; 32 4.785,21.734; 33 9.185,22.534; 34 4.785,22.534; 35 9.185,23.334; 36 4.785,23.334; 37 9.185,24.134; 38 4.785,24.134; 39 9.185,24.934; 40 4.785,24.934; 41 9.185,25.734; 42 4.785,25.734; 43 9.185,26.534; 44 4.785,26.534; 45 9.185,27.334; 46 4.785,27.334; 47 9.185,28.134; 48 4.785,28.134; 49 9.185,28.934; 50 4.785,28.934; 51 9.185,29.734; 52 4.785,29.734; 53 9.185,30.534; 54 4.785,30.534; 55 9.185,31.334; 56 4.785,31.334; 57 9.185,32.134; 58 4.785,32.134; 59 9.185,32.934; 60 4.785,32.934; 61 9.185,33.734; 62 4.785,33.734; 63 9.185,34.534; 64 4.785,34.534; 65 9.185,35.334; 66 4.785,35.334; 67 9.185,36.134; 68 4.785,36.134; 69 9.185,36.934; 70 4.785,36.934; 71 9.185,37.734; 72 4.785,37.734; 73 9.185,38.534; 74 4.785,38.534; 75 9.185,39.334; 76 4.785,39.334; 77 9.185,40.134; 78 4.785,40.134; 79 9.185,40.934; 80 4.785,40.934; 81 9.185,41.734; 82 4.785,41.734; 83 9.185,42.534; 84 4.785,42.534; 85 9.185,43.334; 86 4.785,43.334; 87 9.185,44.134; 88 4.785,44.134; 89 9.185,44.934; 90 4.785,44.934; 91 9.185,45.734; 92 4.785,45.734; 93 9.185,46.534; 94 4.785,46.534; 95 9.185,47.334; 96 4.785,47.334; 97 9.185,48.134; 98 4.785,48.134; 99 9.185,48.934; 100 4.785,48.934 | hole 3.2: 52.705,3.937 | hole 1.2: 6.985,51.435 | hole 0.8: 6.985,7.239
SOT223 = smd 1.219 x 2.235: 1 -2.311,-3.099; 2 0,-3.099; 3 2.311,-3.099 | smd 3.6 x 2.2: 4 0,3.099

### Placement (x,y rotation side)
C1  12.95,55.88 90 top
C2  12.95,59.44 270 top
C3  38.61,20.57 0 top
C4  54.61,46.74 0 top
C5  31.75,46.74 0 top
C6  41.66,32 270 top
C7  21.59,15.49 180 top
C8  41.66,9.14 270 top
GPIO  49.53,50.8 90 top
I2C  36.07,24.64 90 top
LURE1  0,0 0 top
SDIO  26.67,50.8 90 top
SPI  45.72,37.08 0 top
U$6  13.72,4.57 0 top
U$7  PA_LOGO_SYMMED  [PA_LOGO_AGENT_MED_SYM]  13.72,4.57 0 bottom
U$8  9.65,8.64 0 top
U$10  13.72,4.57 0 top
UART1  26.67,11.43 270 top
UART2  45.72,14.22 0 top
VR1  6.86,57.66 90 top

### Tracks (layer width: path | path; a pad name or v marks a point on that pad's centre or on a via)
3V3
  Top 1.016: VR1.3 12.64,59.97 C2.1 33.02,60.29 | 33.02,60.29 52.74,60.29 55.88,57.15 GPIO.12 GPIO.6 55.88,46.74 | 55.88,30.99 55.88,26.42 | 55.88,26.42 55.88,7.87 | 55.88,7.87 55.88,3.05 53.85,1.02 24.13,1.02 20.32,4.83 UART1.12 UART1.6 20.32,15.07 C7.2 | 55.88,7.87 UART2.12 UART2.6 42.33,7.87 C8.2 | 55.88,30.99 55.63,30.73 SPI.12 SPI.6 42.08,30.73 C6.2 | 55.88,46.74 55.88,30.99 | C4.2 55.88,46.74 | C5.2 33.02,47.16 SDIO.6 SDIO.12 33.02,60.29 | C3.2 39.88,20.99 I2C.7 I2C.8 55.37,25.91 55.88,26.42
5V0  (via drill 0.36)
  Top 0.813: VR1.1 12.64,55.35 C1.1
  Top 1.016: 6.86,53.59 v8.64,53.59 | v8.64,53.59 9.14,53.59 | 9.91,53.85 9.91,55.3 VR1.1 | v5.33,53.59 v8.64,53.59
  Bottom 0.305: LURE1.99 9.19,50 9.14,50.04 | LURE1.100 4.79,49.74 4.83,49.78
  Bottom 1.016: 9.14,50.04 9.14,52.07 v8.64,53.59 | 4.83,49.78 4.83,53.09 v5.33,53.59
  pour Bottom (isolate 0.305): 2.03,55.88 2.03,45.47 6.35,45.47 6.35,46.23 11.18,46.23 11.18,55.88
  pour Top (isolate 0.305): 2.03,55.88 2.03,53.09 14.22,53.09 14.22,55.88
!SDIO_CD
  Bottom 0.203: SDIO.9 26.67,50.8 28.45,50.8 29.21,51.56 29.21,52.58 26.16,55.63 5.33,55.63 1.78,52.07 1.78,41.4 3.81,39.37 4.57,39.37 LURE1.76
CTS1
  Bottom 0.254: UART1.1 31.75,11.43 26.16,11.43 25.65,11.94 25.65,12.45 UART1.4
CTS2
  Bottom 0.254: UART2.1 44.96,20.57 45.72,19.81 45.72,14.22 UART2.4
DTR1
  Bottom 0.254: UART1.10 UART1.9
DTR2
  Bottom 0.254: UART2.9 UART2.10
GND  (via drill 0.36)
  Top 0.813: C2.2 12.95,57.66 12.7,57.66 VR1.2
  Top 1.016: UART2.5 41.82,10.41 C8.1 | UART1.5 22.86,15.07 C7.1 | SPI.5 42.08,33.27 C6.1 | SDIO.5 30.48,47.16 C5.1 | C1.2 12.95,57.66 | v15.49,57.66 12.7,57.66 | C4.1 53.76,46.82 53.34,47.24 GPIO.5 | I2C.5 37.34,20.99 C3.1
  Bottom 0.203: 52.32,49.28 52.2,49.28
  Bottom 1.016: 55.88,10.67 55.88,3.05 53.85,1.02 24.13,1.02 22.86,2.29 UART1.11 UART1.5 | 55.88,10.67 55.88,28.45 | 55.88,28.45 55.88,33.27 | 55.88,33.27 55.88,44.45 53.34,46.99 GPIO.5 GPIO.11 53.34,55.88 51.56,57.66 30.73,57.66 | 55.88,33.27 SPI.11 SPI.5 | 55.88,10.67 55.63,10.41 UART2.11 UART2.5 | 30.73,57.66 v15.49,57.66 | SDIO.5 SDIO.11 30.48,57.4 30.73,57.66 | I2C.5 I2C.6 37.34,27.43 37.85,27.94 55.37,27.94 55.88,28.45
  pour Bottom (isolate 0.305, rank 2): 0,62.23 0,0 57.15,0 57.15,62.23
  pour Top (isolate 0.305, rank 2): 0,62.23 0,0 57.15,0 57.15,62.23
GPIO0  (via drill 0.36)
  Top 0.203: GPIO.1 v33.02,39.37
  Bottom 0.203: v33.02,39.37 9.4,39.37 LURE1.75
GPIO1  (via drill 0.36)
  Top 0.203: GPIO.2 v36.32,40.13
  Bottom 0.203: v36.32,40.13 9.4,40.13 LURE1.77
GPIO2  (via drill 0.36)
  Top 0.203: GPIO.3 v39.88,41.15
  Bottom 0.203: v39.88,41.15 9.4,41.15 LURE1.79
GPIO3
  Bottom 0.203: GPIO.4 49.53,48.26 46.99,48.26 40.64,41.91 9.4,41.91 LURE1.81
GPIO4
  Bottom 0.203: GPIO.7 33.78,42.67 9.4,42.67 LURE1.83
GPIO5
  Bottom 0.203: GPIO.8 44.45,53.34 42.67,53.34 32.77,43.43 9.4,43.43 LURE1.85
GPIO6
  Bottom 0.203: GPIO.9 46.48,53.85 42.42,53.85 32.77,44.2 9.4,44.2 LURE1.87
GPIO7
  Bottom 0.203: GPIO.10 48.51,54.36 42.16,54.36 32.77,44.96 9.4,44.96 LURE1.89
RXD1  (via drill 0.36)
  Top 0.254: v27.94,17.78 UART1.3
  Bottom 0.254: LURE1.55 13.62,31.33 14.22,30.73 14.22,18.03 14.99,17.27 26.67,17.27 v27.94,17.78
RXD2  (via drill 0.36)
  Top 0.254: v29.46,19.81 v32.77,16.51
  Bottom 0.254: LURE1.59 14.06,32.93 15.24,31.75 15.24,20.83 16.26,19.81 v29.46,19.81 | v32.77,16.51 33.78,15.49 UART2.3
SCL0
  Bottom 0.254: I2C.1 I2C.2 16.76,25.91 16,26.67 16,32 14.27,33.73 LURE1.61
SDA0
  Bottom 0.254: I2C.3 I2C.4 34.8,26.42 33.27,27.94 17.53,27.94 16.76,28.7 16.76,32.77 15,34.53 LURE1.63
SDIO_CLK  (via drill 0.36)
  Top 0.203: v7.37,40.39 18.8,40.39 SDIO.4
  Bottom 0.203: v7.37,40.39 6.86,40.89 4.83,40.89 LURE1.80
SDIO_CMD  (via drill 0.36)
  Top 0.203: v7.37,41.91 15.24,41.91 SDIO.2
  Bottom 0.203: v7.37,41.91 4.83,41.91 LURE1.82
SDIO_DAT0  (via drill 0.36)
  Top 0.203: v6.6,42.67 6.6,41.4 6.86,41.15 17.02,41.15 SDIO.3
  Bottom 0.203: v6.6,42.67 4.83,42.67 LURE1.84
SDIO_DAT1  (via drill 0.36)
  Top 0.203: v7.37,43.43 11.68,43.43 SDIO.7
  Bottom 0.203: v7.37,43.43 4.83,43.43 LURE1.86
SDIO_DAT2  (via drill 0.36)
  Top 0.203: v6.6,44.2 7.87,44.2 17.02,53.34 21.59,53.34 SDIO.8
  Bottom 0.203: v6.6,44.2 4.83,44.2 LURE1.88
SDIO_DAT3
  Bottom 0.203: SDIO.1 15.24,54.61 8.38,54.61 5.84,52.07 5.84,51.31 6.1,51.05 6.1,45.21 5.84,44.96 4.83,44.96 LURE1.90
SDIO_WP
  Bottom 0.203: SDIO.10 24.89,55.12 5.59,55.12 3.3,52.83 3.3,40.64 3.81,40.13 4.57,40.13 LURE1.78
SPI_MISO
  Bottom 0.254: LURE1.73 15.82,38.53 17.27,37.08 38.1,37.08 39.12,38.1 44.2,38.1 SPI.3
SPI_MOSI  (via drill 0.36)
  Top 0.254: v39.62,37.08 39.62,38.1 42.42,40.89 SPI.2
  Bottom 0.254: LURE1.71 15.61,37.73 17.02,36.32 38.86,36.32 v39.62,37.08
SPI_SCK
  Bottom 0.254: LURE1.67 14.92,36.13 16.51,34.54 40.89,34.54 42.16,35.81 SPI.4
SPI_SS
  Bottom 0.254: LURE1.69 15.14,36.93 16.76,35.31 39.88,35.31 41.66,37.08 45.21,37.08 45.72,37.59 45.72,42.16 SPI.1
TXD1
  Bottom 0.254: UART1.2 30.48,16 29.72,16.76 14.48,16.76 13.72,17.53 13.72,29.72 12.9,30.53 LURE1.53
TXD2
  Bottom 0.254: LURE1.57 13.84,32.13 14.73,31.24 14.73,20.07 15.75,19.05 28.19,19.05 29.21,18.03 UART2.2

### Text on the board
tPlace: www.patternagents.com | "Hula Poppy" | V1.0 | MinnowBoard Lure Type C
bPlace: www.patternagents.com | MinnowBoard Lure Type C | "Hula Poppy" | V1.0